# EAGLE schematic 180dof-pt (EAGLE 5.04)
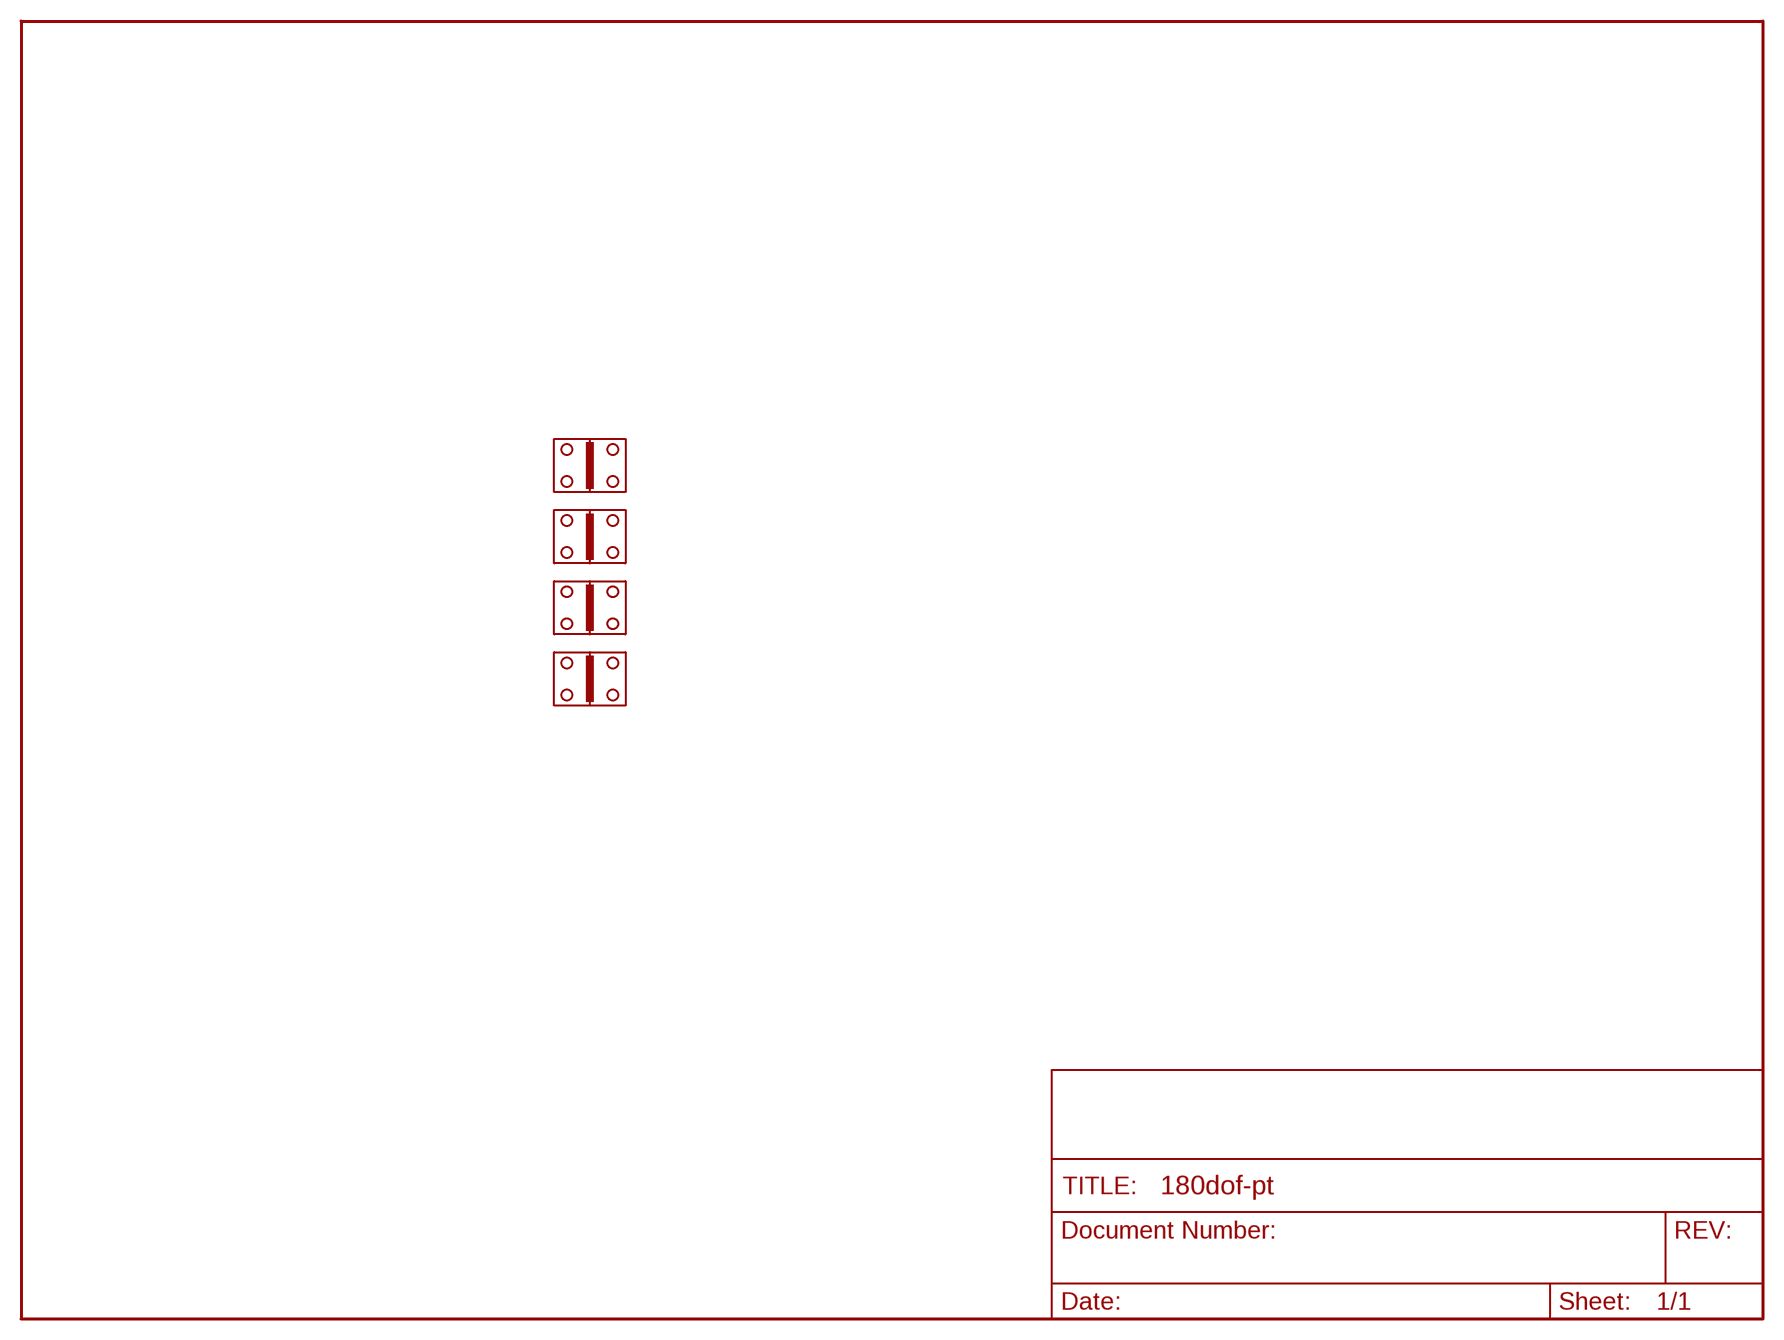
[diagram p0: schematic, sheet 1]

## Parts
U$48  GOLD_HINDGESTANDARD  [GOLD_HINDGE]
U$49  GOLD_HINDGESTANDARD  [GOLD_HINDGE]
U$50  GOLD_HINDGESTANDARD  [GOLD_HINDGE]
U$51  GOLD_HINDGESTANDARD  [GOLD_HINDGE]

## Library data of the parts
U$48-U$51 = JoelEB:GOLD_HINDGE